# EAGLE board BEP33_2panel_test (EAGLE 6.4), part 1 of 2
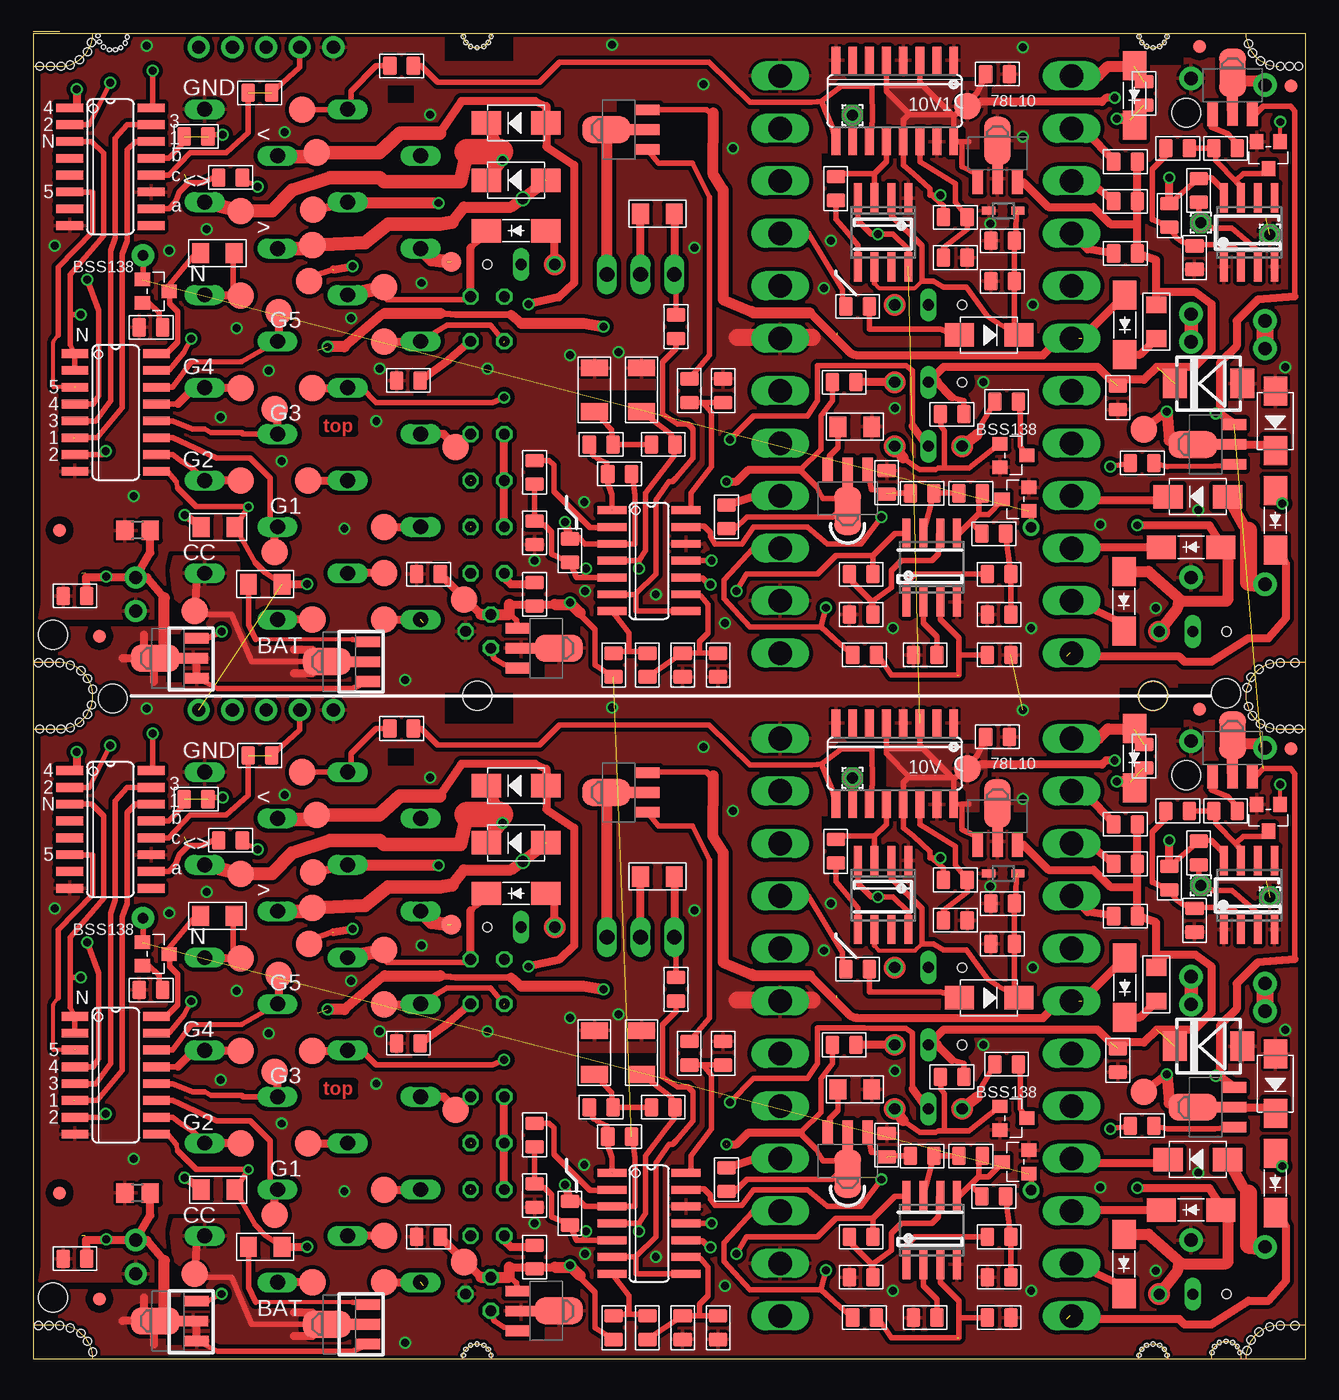
[diagram p4: board, top side]
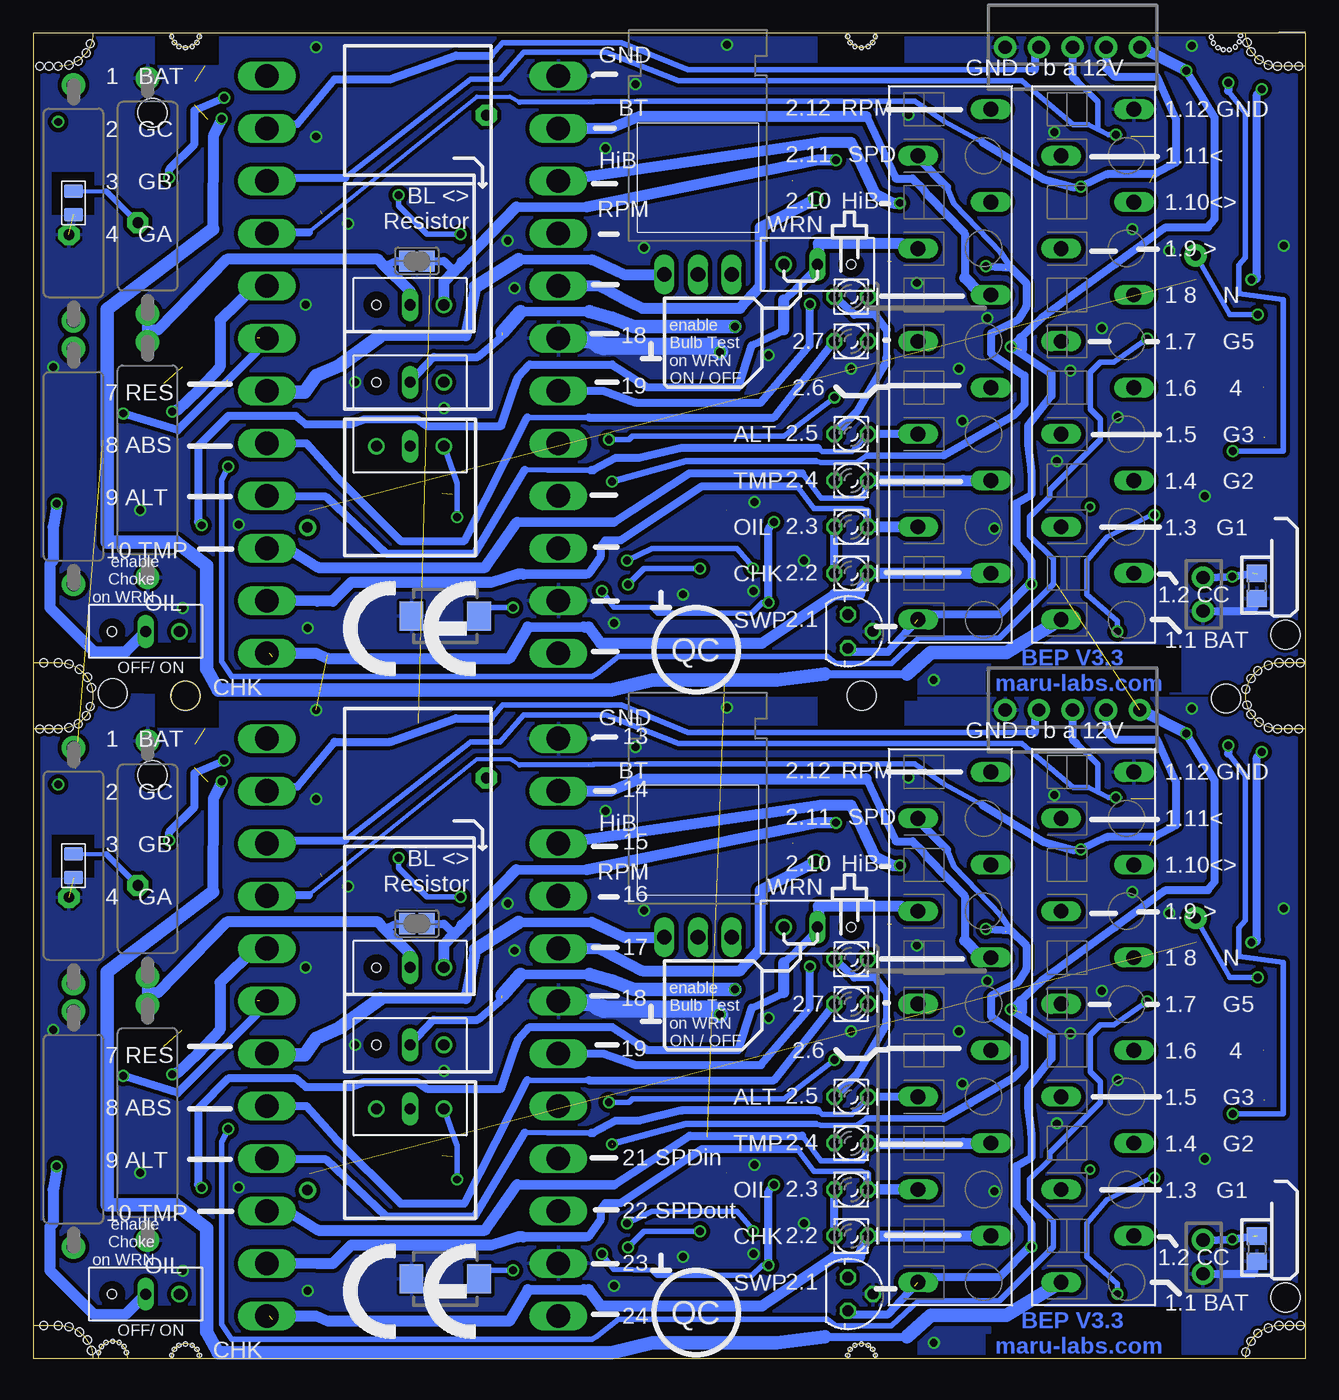
[diagram p5: board, bottom side, seen from below]

Size 96 x 100 mm. Coordinates in mm from the lower left corner, seen from the top.
Outline: 0,0 96,0 96,100 0,100 0,0
Copper layers (1*16): Top 0.035mm / dielectric 1.5mm / Bottom 0.035mm
Design rules "Vorlage BEP3 und hoeher multi-cb_035um-cu": minimum track width 6mil, minimum drill 12mil, track to track 12mil, track to pad 12mil, pad to pad 6mil, via to via 6mil, smd to smd 6mil, copper to edge 10mil, drill to drill 8mil, minimum pad ring 8mil, minimum via ring 6mil, stop-mask expansion 3mil, vias tented up to drill 0mil, thermal gap 8mil
Holes 2.18 mm at 1.5,4.6 87,44 6,49.8 1.5,54.6 87,94 90,50.2
Holes 2.2 mm at 84.5,50 33.5,50 33.5,50 84.5,50
Holes 0.6 mm at 4.4,49.3 4.1,48.6 3.5,48 2.8,47.6 2.1,47.5 1.3,47.5 0.5,47.5 0.4,2.5 1.2,2.5 2,2.5 2.8,2.3 3.6,1.9 4.1,1.3 4.5,0.5 91.6,0.6 91.9,1.4 92.5,2 93.3,2.4 94.1,2.5 95.2,2.5 95.5,47.5 94.8,47.5 94.1,47.5 93.3,47.6 92.6,47.9 92,48.5 91.7,49.2 4.4,99.3 4.1,98.6 3.5,98 2.8,97.6 2.1,97.5 1.3,97.5 0.5,97.5 0.4,52.5 1.2,52.5 2,52.5 2.8,52.3 3.6,51.9 4.1,51.3 4.5,50.5 91.6,50.6 91.9,51.4 92.5,52 93.3,52.4 94.1,52.5 95.2,52.5 95.5,97.5 94.8,97.5 94.1,97.5 93.3,97.6 92.6,97.9 92,98.5 91.7,99.2
Holes 0.3 mm at 7.1,99.7 6.95,99.25 6.6,98.9 6.2,98.75 5.75,98.75 5.3,98.95 5,99.35 4.9,99.8 34.55,99.75 34.35,99.3 34,99 33.5,98.9 33,99 32.65,99.3 32.45,99.75 85.55,99.75 85.35,99.3 85,99 84.5,98.9 84,99 83.65,99.3 83.45,99.75 83.45,0.25 83.65,0.7 84,1 84.5,1.1 85,1 85.35,0.7 85.55,0.25 32.45,0.25 32.65,0.7 33,1 33.5,1.1 34,1 34.35,0.7 34.55,0.25 88.95,0.45 89.15,0.9 89.5,1.2 90,1.3 90.5,1.2 90.85,0.9 91.05,0.45
tRestrict: area 41,19.7 to 47.5,23; area 26.8,44.7 to 28.7,46; area 58.4,15.3 to 60.2,17.3; area 44.1,40.6 to 45.5,44.9; area 37.3,1.4 to 38.6,5.9; area 38.6,4.6 to 41.3,5.8; area 10,1.1 to 11.4,4.6; area 70.3,39.9 to 75,41.2; area 88.4,21.1 to 90,22.3; area 86.4,48.2 to 89.7,50.9; area 31.1,47.9 to 36.2,50.2; area 82,47.6 to 86.8,50.6; 17 more areas
bRestrict: area 9.4,0.3 to 19.6,3.8; area 19.5,0.3 to 24.1,1.8; area 29.3,-0.4 to 35.8,1.8; area 30.3,47.8 to 36.8,50.2; area 81.6,0.2 to 87.6,4; area 82,47.6 to 86.8,50.6; area 91.4,36.3 to 94.6,39.5; area 9.4,50.3 to 19.6,53.9; area 19.5,50.3 to 24.1,51.8; area 29.3,49.6 to 35.8,51.8; area 30.3,97.8 to 36.8,100.2; area 81.6,50.2 to 87.6,54; 3 more areas
Milling: 34 lines

## Footprints (pad centres in the part's own frame; a part is rotated, then mirrored left to right if it is on the bottom)
12-PIN = drill 1.118 long: 1 19.25,-2.45; 2 15.75,3.05; 3 12.25,-2.45; 4 8.75,3.05; 5 5.25,-2.45; 6 1.75,3.05; 7 -1.75,-2.45; 8 -5.25,3.05; 9 -8.75,-2.45; 10 -12.25,3.05; 11 -15.75,-2.45; 12 -19.25,3.05
B2.0 = smd 2 x 2: TP 0,0
C0805 = smd 1.397 x 1.016: 1 0,0.889; 2 0,-0.889
C1206 = smd 1.27 x 2.032: 1 -1.651,0; 2 1.651,0
DO-214AC_SLIM = smd 2.2 x 1.77: 1 -2.242,0; 2 2.242,0
DO-214AC = smd 2.2 x 1.77: 1 -2.242,0; 2 2.242,0
SOD323 = smd 1 x 0.6: 1 -1.1,0; 2 1.1,0
DO214AA = smd 1.8 x 2.2: A 2.55,0; C -2.55,0
DO214AA_BI = smd 1.8 x 2.2: A 2.45,0; C -2.65,0
FIDUCIAL_1MM = smd 1 x 1: 1 0,0
SO08 = smd 0.6 x 2.2: 1 -1.905,-2.6; 2 -0.635,-2.6; 3 0.635,-2.6; 4 1.905,-2.6; 5 1.905,2.6; 6 0.635,2.6; 7 -0.635,2.6; 8 -1.905,2.6
SO16 = smd 0.66 x 2.032: 1 -4.445,-3.073; 2 -3.175,-3.073; 3 -1.905,-3.073; 4 -0.635,-3.073; 5 0.635,-3.073; 6 1.905,-3.073; 7 3.175,-3.073; 8 4.445,-3.073; 9 4.445,3.073; 10 3.175,3.073; 11 1.905,3.073; 12 0.635,3.073; 13 -0.635,3.073; 14 -1.905,3.073; 15 -3.175,3.073; 16 -4.445,3.073
78LXX = drill 0.813 octagon: GND 0,1.905; IN 1.27,0; OUT -1.27,0
TO220H_NOHOLE = drill 1.118 long: 1 -2.54,-10.16; 2 0,-10.16; 3 2.54,-10.16
SO14 = smd 0.6 x 2.2: 1 -3.81,-2.8; 2 -2.54,-2.8; 3 -1.27,-2.8; 4 0,-2.8; 5 1.27,-2.8; 6 2.54,-2.8; 7 3.81,-2.8; 8 3.81,2.8; 9 2.54,2.8; 10 1.27,2.8; 11 0,2.8; 12 -1.27,2.8; 13 -2.54,2.8; 14 -3.81,2.8
SOT89_ROUND = smd 0.8 x 1.8: 1 -1.499,-2.181; 3 1.499,-2.181 | smd 0.8 x 2.3: 2 0,-1.927 | smd 2.032 x 3.65: 2@1 0,0.94
JP2_SMALLPADS = drill 0.85: 1 -2.54,0 | drill 0.85 long: 2 0,0 | hole 0.7: 2.54,0
JP2_ORIG_SMALLPADS = drill 0.85: 1 -2.54,0; 3 2.54,0 | drill 0.85 long: 2 0,0
LD260 = drill 0.813 octagon: A -1.27,0; K 1.27,0
1,6/0,8 = drill 0.813 pad 1.6 octagon: 1 0,0
SOT-23 = smd 1.016 x 1.143: 1 -0.889,-1.016; 2 0.889,-1.016; 3 0,1.016
SOT89 = smd 0.8 x 1.8: 1 -1.499,-2.181; 3 1.499,-2.181 | smd 0.8 x 2.3: 2 0,-1.927 | smd 2.032 x 3.65: 2@1 0,0.94
R0805 = smd 1.397 x 1.016: 1 0,0.889; 2 0,-0.889
R1206 = smd 1.27 x 1.524: 1 -1.27,0; 2 1.27,0
V235/17_1MM = drill 1 pad 1.778: 1 -8.89,0; 2 8.89,0
R0805' = smd 1.3 x 1.5: 1 -0.95,0; 2 0.95,0
SJ = smd 1.2 x 1.6: 1 -0.725,0; 2 0.725,0
B1,27 = smd 1.5 x 1.5: TP 0,0
24-PIN_V2 = drill 1.778 long: 1 -21.78,-11; 2 -17.82,-11; 3 -13.86,-11; 4 -9.9,-11; 5 -5.94,-11; 6 -1.98,-11; 7 1.98,-11; 8 5.94,-11; 9 9.9,-11; 10 13.86,-11; 11 17.82,-11; 12 21.78,-11; 13 -21.78,11; 14 -17.82,11; 15 -13.86,11; 16 -9.9,11; 17 -5.94,11; 18 -1.98,11; 19 1.98,11; 20 5.94,11; 21 9.9,11; 22 13.86,11; 23 17.82,11; 24 21.78,11
22-23-2051 = drill 1 pad 1.676: 1 -5.08,0; 2 -2.54,0; 3 0,0; 4 2.54,0; 5 5.08,0
22-23-2021 = drill 1 pad 1.676: 1 -1.27,0; 2 1.27,0

## Placement (x,y rotation side)
1  [12-PIN]  15.99,25 270 bottom
2  [12-PIN]  26.79,25 270 bottom
3  [12-PIN]  15.99,75 270 bottom
4  [12-PIN]  26.79,75 270 bottom
6V  TPSB2.0  [B2.0]  32.5,7.28 0 top
6V1  TPSB2.0  [B2.0]  32.5,57.28 0 top
10V  TPSB2.0  [B2.0]  70.5,44.5 0 top
10V1  TPSB2.0  [B2.0]  70.5,94.5 0 top
C1  10uF  [C0805]  81.84,22.5 0 top
C2  100nF,  [C0805]  87.63,33.06 180 top
C3  100u  [C1206]  42.34,73.09 90 top
C4  100u  [C1206]  45.9,73.09 90 top
C5  100nF,  [C0805]  29.83,59.18 270 top
C6  4.7u  [C0805]  72.89,53.09 90 top
C7  100nF.  [C0805]  49.01,52.33 0 top
C8  100nF.  [C0805]  52.06,73.03 0 top
C9  2.2nF  [C0805]  73.14,81.28 90 top
C10  100nF  [C0805]  72.76,96.9 90 top
C11  100nF  [C0805]  69.58,83.06 90 top
C12  100nF,  [C0805]  72.89,56.14 270 top
C13  10uF  [C0805]  81.84,72.5 0 top
C14  100nF,  [C0805]  87.63,83.06 180 top
C101  4.7u  [C0805]  72.89,3.09 90 top
C102  100nF  [C0805]  72.76,46.9 90 top
C103  100nF,  [C0805]  72.89,6.14 270 top
C104  100nF,  [C0805]  29.83,9.18 270 top
C105  100nF.  [C0805]  49.01,2.33 0 top
C106  100nF.  [C0805]  52.06,23.03 0 top
C107  100u  [C1206]  42.34,23.09 90 top
C108  100u  [C1206]  45.9,23.09 90 top
C109  2.2nF  [C0805]  73.14,31.28 90 top
C110  100nF  [C0805]  69.58,33.06 90 top
D1  SS12  [DO-214AC_SLIM]  82.36,27.99 270 top
D2  SS12  [DO-214AC_SLIM]  83.1,45.3 270 top
D3  1N4007,  [DO-214AC]  36.44,88.9 180 top
D4  [SOD323]  73.2,36.6 180 top
D5  1N4007,  [DO-214AC]  36.44,93.22 180 top
D6  1N4007.  [DO-214AC]  87.87,65.03 180 top
D7  1N5817  [DO-214AC_SLIM]  87.36,61.22 180 top
D8  1N5817.  [DO-214AC_SLIM]  82.3,57.14 270 top
D9  1N5817.  [DO-214AC_SLIM]  93.73,63.25 270 top
D10  1N5817  [DO-214AC_SLIM]  36.44,85.09 180 top
D11  1N4007.  [DO-214AC]  93.73,70.74 270 top
D12  1N4007  [DO-214AC]  72.12,77.22 0 top
D13  SM6T  [DO214AA]  88.69,73.57 0 top
D14  SM6TDO214AA_BI  [DO214AA_BI]  65.01,56.01 180 bottom
D15  SS12  [DO-214AC_SLIM]  82.36,77.99 270 top
D16  SS12  [DO-214AC_SLIM]  83.1,95.3 270 top
D17  [SOD323]  73.2,86.6 180 top
D101  SM6T  [DO214AA]  88.69,23.57 0 top
D102  1N4007,  [DO-214AC]  36.44,38.9 180 top
D103  1N4007,  [DO-214AC]  36.44,43.22 180 top
D104  SM6TDO214AA_BI  [DO214AA_BI]  65.01,6.01 180 bottom
D105  1N4007.  [DO-214AC]  93.73,20.74 270 top
D106  1N4007.  [DO-214AC]  87.87,15.03 180 top
D107  1N5817  [DO-214AC_SLIM]  87.36,11.22 180 top
D108  1N5817.  [DO-214AC_SLIM]  82.3,7.14 270 top
D109  1N5817.  [DO-214AC_SLIM]  93.73,13.25 270 top
D110  1N5817  [DO-214AC_SLIM]  36.44,35.09 180 top
D112  1N4007  [DO-214AC]  72.12,27.22 0 top
FID3  FIDUCIAL  [FIDUCIAL_1MM]  88,99 0 top
FID4  FIDUCIAL  [FIDUCIAL_1MM]  2,62.5 0 top
FID5  FIDUCIAL  [FIDUCIAL_1MM]  5,54.5 0 top
FID6  FIDUCIAL  [FIDUCIAL_1MM]  94.9,96 0 top
FID101  FIDUCIAL  [FIDUCIAL_1MM]  88,49 0 top
FID102  FIDUCIAL  [FIDUCIAL_1MM]  2,12.5 0 top
FID103  FIDUCIAL  [FIDUCIAL_1MM]  5,4.5 0 top
FID104  FIDUCIAL  [FIDUCIAL_1MM]  94.9,46 0 top
IC1  LM311D  [SO08]  91.76,34.97 0 top
IC2  4028  [SO16]  5.83,89.92 270 top
IC3  6V pos  [78LXX]  34.53,54.87 270 bottom
IC4  317TO202H_NOHOLE  [TO220H_NOHOLE]  45.84,91.95 0 bottom
IC5  ULN2004  [SO16]  6.23,71.38 270 top
IC6  LM339  [SO14]  46.47,60.2 270 top
IC7  78L06  [SOT89_ROUND]  38.72,53.6 270 top
IC8  555  [SO08]  64.12,84.97 180 top
IC9  4538  [SO16]  65.01,94.87 180 top
IC10  78L10  [SOT89_ROUND]  72.76,90.93 0 top
IC11  LM2904  [SO08]  67.81,59.69 0 top
IC12  LM311D  [SO08]  91.76,84.97 0 top
IC101  LM2904  [SO08]  67.81,9.69 0 top
IC102  78L06  [SOT89_ROUND]  38.72,3.6 270 top
IC103  6V pos  [78LXX]  34.53,4.87 270 bottom
IC104  78L10  [SOT89_ROUND]  72.76,40.93 0 top
IC105  4028  [SO16]  5.83,39.92 270 top
IC107  ULN2004  [SO16]  6.23,21.38 270 top
IC108  LM339  [SO14]  46.47,10.2 270 top
IC109  317TO202H_NOHOLE  [TO220H_NOHOLE]  45.84,41.95 0 bottom
IC110  555  [SO08]  64.12,34.97 180 top
IC111  4538  [SO16]  65.01,44.87 180 top
JP1  [JP2_SMALLPADS]  67.55,73.66 180 bottom
JP2  JP2E_ORIG  [JP2_ORIG_SMALLPADS]  67.55,68.84 180 bottom
JP3  [JP2_SMALLPADS]  87.5,54.85 180 bottom
JP4  [JP2_SMALLPADS]  36.82,82.55 0 bottom
JP5  [JP2_SMALLPADS]  67.55,79.5 180 bottom
JP101  [JP2_SMALLPADS]  67.55,23.66 180 bottom
JP102  [JP2_SMALLPADS]  87.5,4.85 180 bottom
JP103  [JP2_SMALLPADS]  36.82,32.55 0 bottom
JP104  [JP2_SMALLPADS]  67.55,29.5 180 bottom
JP105  JP2E_ORIG  [JP2_ORIG_SMALLPADS]  67.55,18.84 180 bottom
LED1  [LD260]  34.28,59.25 0 bottom
LED2  [LD260]  34.28,62.75 0 bottom
LED3  [LD260]  34.28,66.25 0 bottom
LED4  [LD260]  34.28,69.75 0 bottom
LED5  [LD260]  34.28,76.75 0 bottom
LED6  [LD260]  34.28,80.12 0 bottom
LED101  [LD260]  34.28,26.75 0 bottom
LED102  [LD260]  34.28,9.25 0 bottom
LED103  [LD260]  34.28,12.75 0 bottom
LED104  [LD260]  34.28,16.25 0 bottom
LED105  [LD260]  34.28,19.75 0 bottom
LED106  [LD260]  34.28,30.12 0 bottom
PAD1  [1,6/0,8]  61.81,43.8 0 top
PAD2  WIREPAD1,6/0,8  [1,6/0,8]  88.1,35.7 0 top
PAD3  WIREPAD1,6/0,8  [1,6/0,8]  93.3,34.8 0 top
PAD4  [1,6/0,8]  61.81,93.8 0 top
PAD5  WIREPAD1,6/0,8  [1,6/0,8]  88.1,85.7 0 top
PAD6  WIREPAD1,6/0,8  [1,6/0,8]  93.3,84.8 0 top
Q1  J1  [SOT-23]  74.12,14.83 90 top
Q2  BA  [SOT89]  90.49,46.08 0 top
Q3  J1  [SOT-23]  93.2,40.8 180 top
Q4  BA  [SOT89]  88.44,68.96 90 top
Q5  BA.  [SOT89]  10.15,52.83 90 top
Q6  BA.  [SOT89]  23.1,52.58 90 top
Q7  BA  [SOT89]  44.18,92.71 90 top
Q8  MY  [SOT89]  61.46,64.9 180 top
Q9  J1  [SOT-23]  73.97,68.14 270 top
Q10  J1  [SOT-23]  9.26,80.52 270 top
Q11  J1  [SOT-23]  74.12,64.83 90 top
Q12  BA  [SOT89]  90.49,96.08 0 top
Q13  J1  [SOT-23]  93.2,90.8 180 top
Q101  BA.  [SOT89]  23.1,2.58 90 top
Q102  BA.  [SOT89]  10.15,2.83 90 top
Q103  MY  [SOT89]  61.46,14.9 180 top
Q104  BA  [SOT89]  88.44,18.96 90 top
Q105  BA  [SOT89]  44.18,42.71 90 top
Q106  J1  [SOT-23]  9.26,30.52 270 top
Q107  J1  [SOT-23]  73.97,18.14 270 top
R1  104  [R0805]  17.1,45.5 90 top
R2  104  [R0805]  12.3,42.2 90 top
R3  104  [R0805]  14.9,39.1 90 top
R4  100  [R0805]  8.9,27.8 90 top
R5  13  [R1206]  62,20.3 0 top
R6  102  [R0805]  64.4,16.1 180 top
R7  13  [R1206]  84.75,28.23 90 top
R8  4701  [R0805]  89.97,41.31 270 top
R9  13  [R1206]  13.9,33.4 0 top
R10  102  [R0805]  86.36,41.31 270 top
R11  104  [R0805]  85.72,36.23 0 top
R12  102  [R0805]  87.95,38.14 0 top
R13  100  [R0805]  83.82,45.44 0 top
R14  NTC  [R0805]  92.95,37.19 0 bottom
R15  47  [V235/17_1MM]  92.95,67.31 90 bottom
R16  13  [R1206]  47.1,86.36 180 top
R17  47  [V235/17_1MM]  92.95,87.19 90 bottom
R18  104  [R0805]  82.41,90.3 90 top
R19  104  [R0805]  82.41,87.31 90 top
R20  104  [R0805]  82.41,83.38 90 top
R21  4701  [R0805]  62.73,53.09 270 top
R22  1002  [R0805]  67.3,53.09 90 top
R23  1002  [R0805]  48.5,77.85 180 top
R24  1502  [R0805]  43.8,52.33 0 top
R25  104  [R0805]  42.85,68.96 270 top
R26  104  [R0805]  47.55,68.96 270 top
R27  1502  [R0805]  40.5,60.96 180 top
R28  1002  [R0805]  37.83,62.3 180 top
R29  2201  [R0805]  37.83,66.87 0 top
R30  1002  [R0805]  44.25,66.74 270 top
R31  4701  [R0805]  49.52,73.03 0 top
R32  2702  [R0805]  51.68,52.33 180 top
R33  102  [R0805]  3.16,57.53 270 top
R34  R_user  [R0805']  3.67,58.3 270 bottom
R35  100  [R0805]  52.31,63.5 0 top
R36  (101)  [R0805]  28.31,73.79 270 top
R37  (1000)  [R0805]  37.83,57.66 0 top
R38  102  [R0805]  83.68,67.57 90 top
R39  13  [R1206]  13.96,62.74 180 top
R40  13  [R1206]  17.51,58.42 180 top
R41  2702  [R0805]  46.34,52.33 0 top
R42  2201  [R0805]  67.08,65.28 270 top
R43  100  [R0805]  73.46,72.2 90 top
R44  104  [R0805]  69.33,71.25 270 top
R45  104  [R0805]  73.14,84.33 270 top
R46  (1002)  [R0805]  60.57,88.27 0 top
R47  2702  [R0805]  62.22,79.38 270 top
R48  47  [V235/17_1MM]  87.36,67.82 90 bottom
R49  47  [V235/17_1MM]  87.36,87.7 270 bottom
R50  2702  [R0805]  69.58,86.11 270 top
R51  2201  [R0805]  61.2,73.66 90 top
R52  (1002)  [R0805]  27.8,97.54 90 top
R53  1002  [R0805]  72.89,59.18 270 top
R54  102  [R0805]  72.49,62.23 270 top
R55  2702  [R0805]  70.75,65.28 90 top
R56  102  [R0805]  62.47,59.18 90 top
R57  102  [R0805]  62.47,56.14 90 top
R58  R_user  [R0805']  7.87,62.49 180 top
R59  104  [R0805]  17.1,95.5 90 top
R60  104  [R0805]  12.3,92.2 90 top
R61  104  [R0805]  14.9,89.1 90 top
R62  13  [R1206]  62,70.3 0 top
R63  102  [R0805]  64.4,66.1 180 top
R64  13  [R1206]  84.75,78.23 90 top
R65  100  [R0805]  8.9,77.8 90 top
R66  13  [R1206]  13.9,83.4 0 top
R67  4701  [R0805]  89.97,91.31 270 top
R68  102  [R0805]  86.36,91.31 270 top
R69  104  [R0805]  85.72,86.23 0 top
R70  102  [R0805]  87.95,88.14 0 top
R71  100  [R0805]  83.82,95.44 0 top
R72  NTC  [R0805]  92.95,87.19 0 bottom
R101  102  [R0805]  3.16,7.53 270 top
R102  13  [R1206]  17.51,8.42 180 top
R103  R_user  [R0805']  7.87,12.49 180 top
R104  R_user  [R0805']  3.67,8.29 270 bottom
R105  4701  [R0805]  62.73,3.09 270 top
R106  13  [R1206]  13.96,12.74 180 top
R107  1002  [R0805]  67.3,3.09 90 top
R108  1002  [R0805]  72.89,9.18 270 top
R109  104  [R0805]  82.41,40.3 90 top
R110  104  [R0805]  82.41,37.31 90 top
R111  104  [R0805]  82.41,33.38 90 top
R112  102  [R0805]  72.49,12.23 270 top
R113  102  [R0805]  62.47,9.18 90 top
R114  102  [R0805]  62.47,6.14 90 top
R115  100  [R0805]  52.31,13.5 0 top
R116  2201  [R0805]  67.08,15.28 270 top
R117  2702  [R0805]  70.75,15.28 90 top
R119  2201  [R0805]  61.2,23.66 90 top
R120  1002  [R0805]  48.5,27.85 180 top
R121  1502  [R0805]  43.8,2.33 0 top
R122  2702  [R0805]  46.34,2.33 0 top
R123  2702  [R0805]  51.68,2.33 180 top
R124  1002  [R0805]  44.25,16.74 270 top
R125  104  [R0805]  42.85,18.96 270 top
R126  4701  [R0805]  49.52,23.03 0 top
R127  47  [V235/17_1MM]  92.95,17.31 90 bottom
R128  102  [R0805]  83.68,17.57 90 top
R129  47  [V235/17_1MM]  92.95,37.19 90 bottom
R130  104  [R0805]  47.55,18.96 270 top
R131  1502  [R0805]  40.5,10.96 180 top
R132  1002  [R0805]  37.83,12.3 180 top
R133  2201  [R0805]  37.83,16.87 0 top
R134  13  [R1206]  47.1,36.36 180 top
R135  104  [R0805]  69.33,21.25 270 top
R136  47  [V235/17_1MM]  87.36,17.82 90 bottom
R137  47  [V235/17_1MM]  87.36,37.7 270 bottom
R138  100  [R0805]  73.46,22.2 90 top
R140  2702  [R0805]  62.22,29.38 270 top
R141  104  [R0805]  73.14,34.33 270 top
R142  (1000)  [R0805]  37.83,7.66 0 top
R143  (101)  [R0805]  28.31,23.79 270 top
R144  (1002)  [R0805]  60.57,38.27 0 top
R145  2702  [R0805]  69.58,36.11 270 top
R146  (1002)  [R0805]  27.8,47.54 90 top
SJ1  [SJ]  67.04,82.81 180 bottom
SJ101  [SJ]  67.04,32.81 180 bottom
START  TPSB2.0  [B2.0]  83.81,20.11 0 top
START1  TPSB2.0  [B2.0]  83.81,70.11 0 top
TP1  TPSB2.0  [B2.0]  21.07,5.76 0 top
TP2  TPSB2.0  [B2.0]  12.18,6.39 0 top
TP3  TPSB2.0  [B2.0]  18.21,10.84 0 top
TP4  TPSB2.0  [B2.0]  15.67,16.23 0 top
TP5  TPSB2.0  [B2.0]  18.21,21.63 0 top
TP6  TPSB2.0  [B2.0]  15.67,23.22 0 top
TP7  TPSB2.0  [B2.0]  18.53,28.93 0 top
TP8  TPSB2.0  [B2.0]  15.67,30.2 0 top
TP9  TPSB2.0  [B2.0]  21.07,34.01 0 top
TP10  TPSB2.0  [B2.0]  15.67,36.55 0 top
TP11  TPSB2.0  [B2.0]  21.39,41 0 top
TP12  TPSB2.0  [B2.0]  26.47,5.76 0 top
TP13  TPSB2.0  [B2.0]  20.31,44.24 0 top
TP14  TPSB2.0  [B2.0]  21.07,55.76 0 top
TP15  TPSB2.0  [B2.0]  12.18,56.39 0 top
TP16  TPSB2.0  [B2.0]  26.47,9.25 0 top
TP17  TPSB2.0  [B2.0]  26.47,12.74 0 top
TP18  TPSB2.0  [B2.0]  20.75,16.23 0 top
TP19  TPSB2.0  [B2.0]  31.86,18.77 0 top
TP20  TPSB2.0  [B2.0]  18.21,60.84 0 top
TP21  TPSB2.0  [B2.0]  21.07,23.22 0 top
TP22  TPSB2.0  [B2.0]  26.47,26.71 0 top
TP23  TPSB2.0  [B2.0]  26.47,30.84 0 top
TP24  TPSB1,27  [B1,27]  31.55,32.74 0 top
TP25  TPSB2.0  [B2.0]  21.13,36.68 0 top
TP26  TPSB2.0  [B2.0]  20.82,31.28 0 top
TP27  TPSB2.0  [B2.0]  15.67,66.23 0 top
TP28  TPSB2.0  [B2.0]  18.21,71.63 0 top
TP29  TPSB2.0  [B2.0]  15.67,73.22 0 top
TP30  TPSB2.0  [B2.0]  18.53,78.93 0 top
TP31  TPSB2.0  [B2.0]  15.67,80.2 0 top
TP32  TPSB2.0  [B2.0]  21.07,84.01 0 top
TP33  TPSB2.0  [B2.0]  15.67,86.55 0 top
TP34  TPSB2.0  [B2.0]  21.39,91 0 top
TP35  TPSB2.0  [B2.0]  26.47,59.25 0 top
TP36  TPSB2.0  [B2.0]  26.47,62.74 0 top
TP37  TPSB2.0  [B2.0]  20.75,66.23 0 top
TP38  TPSB2.0  [B2.0]  31.86,68.77 0 top
TP39  TPSB2.0  [B2.0]  21.07,73.22 0 top
TP40  TPSB2.0  [B2.0]  26.47,76.71 0 top
TP41  TPSB2.0  [B2.0]  26.47,80.84 0 top
TP42  TPSB1,27  [B1,27]  31.55,82.74 0 top
TP43  TPSB2.0  [B2.0]  21.13,86.68 0 top
TP44  TPSB2.0  [B2.0]  20.82,81.28 0 top
TP45  TPSB2.0  [B2.0]  26.47,55.76 0 top
TP46  TPSB2.0  [B2.0]  20.31,94.24 0 top
U$1  [CE_10.00]  72.63,1.44 0 bottom
U$2  [CE_10.00]  72.63,51.44 0 bottom
X1  [24-PIN_V2]  67.36,75 270 bottom
X2  22-23-2051  [22-23-2051]  17.58,98.94 180 bottom
X3  22-23-2021  [22-23-2021]  7.74,57.66 90 bottom
X101  [24-PIN_V2]  67.36,25 270 bottom
X102  22-23-2021  [22-23-2021]  7.74,7.66 90 bottom
X103  22-23-2051  [22-23-2051]  17.58,48.94 180 bottom